# Altium schematic sheet S5_Communications.SchDoc: Communications
size Tabloid; DrawnBy: Dhrumil Parikh; SheetNumber: 5; SheetTotal: 6; PageSetup: Record=PageOptions|CenterHorizontal=True|CenterVertical=True|PrintScale=0.62|XCorrection=1.00|YCorrection=1.00|PrintKind=1|BorderSize=5000000|LeftOffset=0|BottomOffset=0|Orientation=2|PaperLength=1000|PaperWidth=1000|Scale=100|PaperSource=7|PrintQuality=600|MediaType=1|DitherType=10|PaperKind=Letter|PrintScaleMode=1; PageSize: T
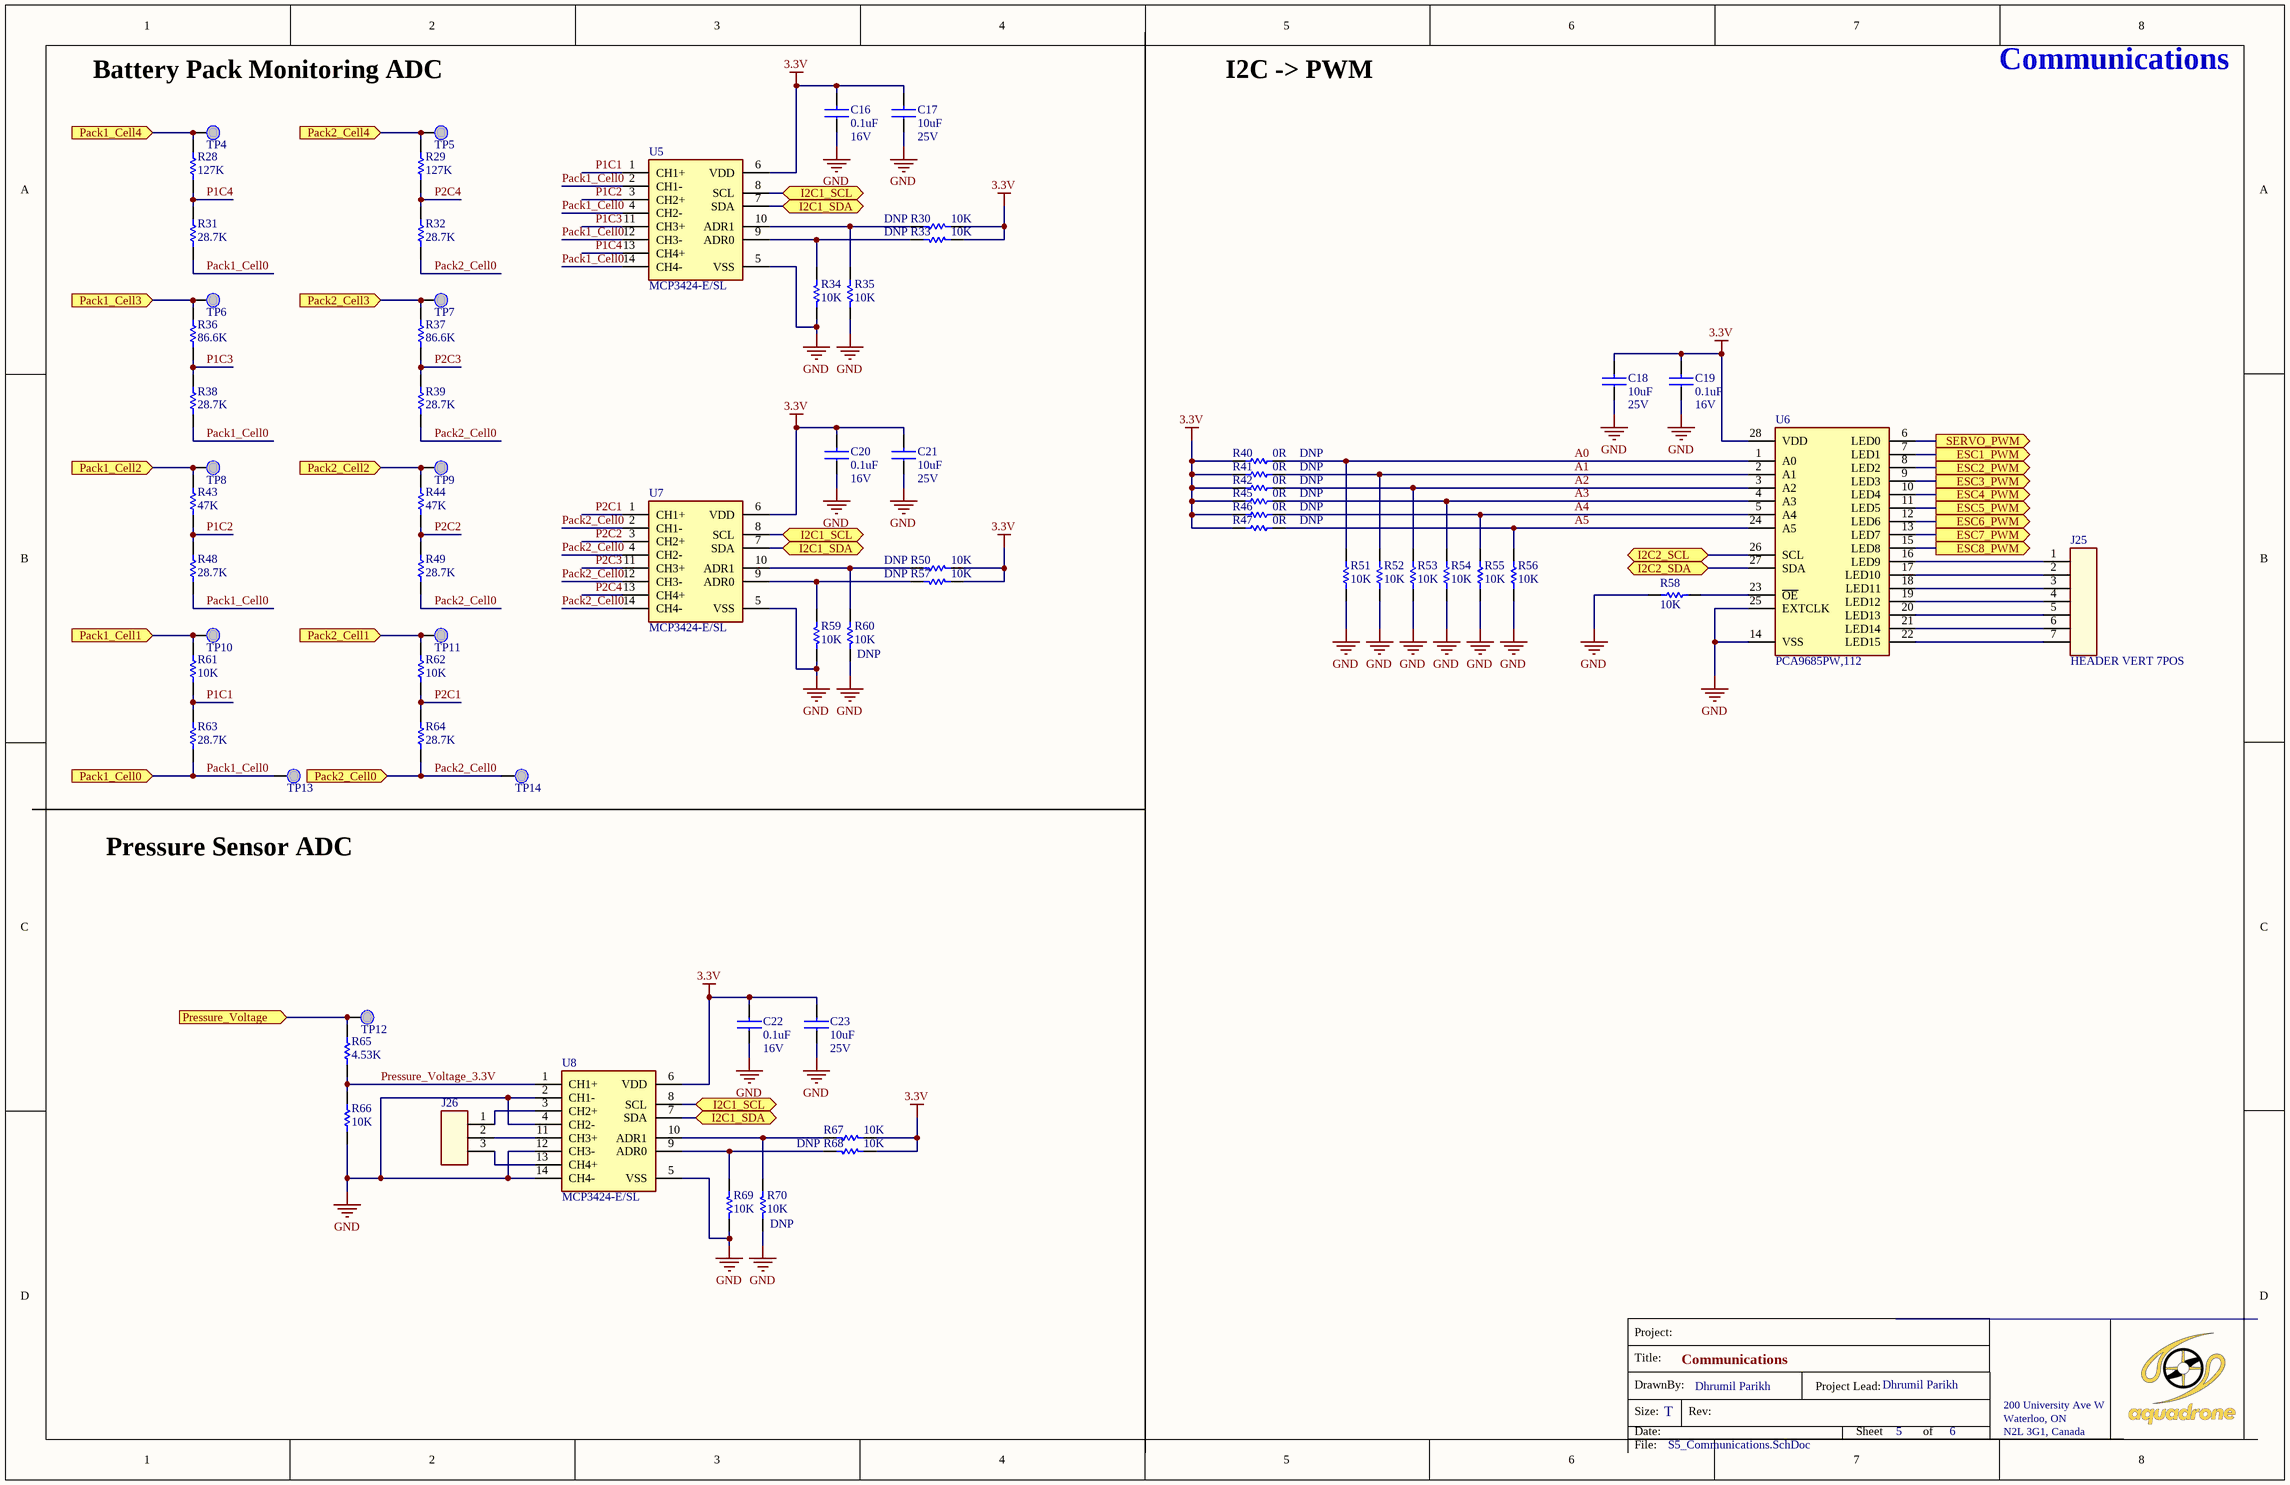
[diagram p0: S5_Communications.SchDoc]

## Parts
C16  value 0.1uF  VOLTAGE: 16V  [CAPC1608X09N]  (hidden comment: CAP CER 0.1UF 16V X7R 0603)
C17  value 10uF  VOLTAGE: 25V  [CAPC1608X09N]  (hidden comment: CAP CER 10UF 25V X5R 0603)
C18  value 10uF  VOLTAGE: 25V  [CAPC1608X09N]  (hidden comment: CAP CER 10UF 25V X5R 0603)
C19  value 0.1uF  VOLTAGE: 16V  [CAPC1608X09N]  (hidden comment: CAP CER 0.1UF 16V X7R 0603)
C20  value 0.1uF  VOLTAGE: 16V  [CAPC1608X09N]  (hidden comment: CAP CER 0.1UF 16V X7R 0603)
C21  value 10uF  VOLTAGE: 25V  [CAPC1608X09N]  (hidden comment: CAP CER 10UF 25V X5R 0603)
C22  value 0.1uF  VOLTAGE: 16V  [CAPC1608X09N]  (hidden comment: CAP CER 0.1UF 16V X7R 0603)
C23  value 10uF  VOLTAGE: 25V  [CAPC1608X09N]  (hidden comment: CAP CER 10UF 25V X5R 0603)
J25  value HEADER VERT 7POS  [61300711121]  (hidden comment: CONN HEADER VERT 7POS 2.54MM)
J26  CONN HEADER VERT 3POS 2.54MM  [61300311121]  (value not drawn)
R28  value 127K  [RESC1608X06N]  (hidden comment: RES SMD 127K OHM 1% 1/10W 0603)
R29  value 127K  [RESC1608X06N]  (hidden comment: RES SMD 127K OHM 1% 1/10W 0603)
R30  value 10K  NOSTUFF: DNP  [RESC1608X06N]  (hidden comment: RES SMD 10K OHM 1% 1/10W 0603)
R31  value 28.7K  [RESC1608X06N]  (hidden comment: RES SMD 28.7K OHM 1% 1/10W 0603)
R32  value 28.7K  [RESC1608X06N]  (hidden comment: RES SMD 28.7K OHM 1% 1/10W 0603)
R33  value 10K  NOSTUFF: DNP  [RESC1608X06N]  (hidden comment: RES SMD 10K OHM 1% 1/10W 0603)
R34  value 10K  [RESC1608X06N]  (hidden comment: RES SMD 10K OHM 1% 1/10W 0603)
R35  value 10K  [RESC1608X06N]  (hidden comment: RES SMD 10K OHM 1% 1/10W 0603)
R36  value 86.6K  [RESC1608X06N]  (hidden comment: RES SMD 86.6K OHM 1% 1/10W 0603)
R37  value 86.6K  [RESC1608X06N]  (hidden comment: RES SMD 86.6K OHM 1% 1/10W 0603)
R38  value 28.7K  [RESC1608X06N]  (hidden comment: RES SMD 28.7K OHM 1% 1/10W 0603)
R39  value 28.7K  [RESC1608X06N]  (hidden comment: RES SMD 28.7K OHM 1% 1/10W 0603)
R40  value 0R  NOSTUFF: DNP  [RESC2012X07N]  (hidden comment: RES SMD 0 OHM JUMPER 1/8W 0805)
R41  value 0R  NOSTUFF: DNP  [RESC2012X07N]  (hidden comment: RES SMD 0 OHM JUMPER 1/8W 0805)
R42  value 0R  NOSTUFF: DNP  [RESC2012X07N]  (hidden comment: RES SMD 0 OHM JUMPER 1/8W 0805)
R43  value 47K  [RESC1608X06N]  (hidden comment: RES SMD 47K OHM 1% 1/10W 0603)
R44  value 47K  [RESC1608X06N]  (hidden comment: RES SMD 47K OHM 1% 1/10W 0603)
R45  value 0R  NOSTUFF: DNP  [RESC2012X07N]  (hidden comment: RES SMD 0 OHM JUMPER 1/8W 0805)
R46  value 0R  NOSTUFF: DNP  [RESC2012X07N]  (hidden comment: RES SMD 0 OHM JUMPER 1/8W 0805)
R47  value 0R  NOSTUFF: DNP  [RESC2012X07N]  (hidden comment: RES SMD 0 OHM JUMPER 1/8W 0805)
R48  value 28.7K  [RESC1608X06N]  (hidden comment: RES SMD 28.7K OHM 1% 1/10W 0603)
R49  value 28.7K  [RESC1608X06N]  (hidden comment: RES SMD 28.7K OHM 1% 1/10W 0603)
R50  value 10K  NOSTUFF: DNP  [RESC1608X06N]  (hidden comment: RES SMD 10K OHM 1% 1/10W 0603)
R51  value 10K  [RESC1608X06N]  (hidden comment: RES SMD 10K OHM 1% 1/10W 0603)
R52  value 10K  [RESC1608X06N]  (hidden comment: RES SMD 10K OHM 1% 1/10W 0603)
R53  value 10K  [RESC1608X06N]  (hidden comment: RES SMD 10K OHM 1% 1/10W 0603)
R54  value 10K  [RESC1608X06N]  (hidden comment: RES SMD 10K OHM 1% 1/10W 0603)
R55  value 10K  [RESC1608X06N]  (hidden comment: RES SMD 10K OHM 1% 1/10W 0603)
R56  value 10K  [RESC1608X06N]  (hidden comment: RES SMD 10K OHM 1% 1/10W 0603)
R57  value 10K  NOSTUFF: DNP  [RESC1608X06N]  (hidden comment: RES SMD 10K OHM 1% 1/10W 0603)
R58  value 10K  [RESC1608X06N]  (hidden comment: RES SMD 10K OHM 1% 1/10W 0603)
R59  value 10K  [RESC1608X06N]  (hidden comment: RES SMD 10K OHM 1% 1/10W 0603)
R60  value 10K  NOSTUFF: DNP  [RESC1608X06N]  (hidden comment: RES SMD 10K OHM 1% 1/10W 0603)
R61  value 10K  [RESC1608X06N]  (hidden comment: RES SMD 10K OHM 1% 1/10W 0603)
R62  value 10K  [RESC1608X06N]  (hidden comment: RES SMD 10K OHM 1% 1/10W 0603)
R63  value 28.7K  [RESC1608X06N]  (hidden comment: RES SMD 28.7K OHM 1% 1/10W 0603)
R64  value 28.7K  [RESC1608X06N]  (hidden comment: RES SMD 28.7K OHM 1% 1/10W 0603)
R65  value 4.53K  [RESC1608X06N]  (hidden comment: RES SMD 4.53K OHM 1% 1/10W 0603)
R66  value 10K  [RESC1608X06N]  (hidden comment: RES SMD 10K OHM 1% 1/10W 0603)
R67  value 10K  [RESC1608X06N]  (hidden comment: RES SMD 10K OHM 1% 1/10W 0603)
R68  value 10K  NOSTUFF: DNP  [RESC1608X06N]  (hidden comment: RES SMD 10K OHM 1% 1/10W 0603)
R69  value 10K  [RESC1608X06N]  (hidden comment: RES SMD 10K OHM 1% 1/10W 0603)
R70  value 10K  NOSTUFF: DNP  [RESC1608X06N]  (hidden comment: RES SMD 10K OHM 1% 1/10W 0603)
TP4  Testpoint 1mm SMD Pad  [TP_SMD_1.0MM]  (value not drawn)  (no BOM)
TP5  Testpoint 1mm SMD Pad  [TP_SMD_1.0MM]  (value not drawn)  (no BOM)
TP6  Testpoint 1mm SMD Pad  [TP_SMD_1.0MM]  (value not drawn)  (no BOM)
TP7  Testpoint 1mm SMD Pad  [TP_SMD_1.0MM]  (value not drawn)  (no BOM)
TP8  Testpoint 1mm SMD Pad  [TP_SMD_1.0MM]  (value not drawn)  (no BOM)
TP9  Testpoint 1mm SMD Pad  [TP_SMD_1.0MM]  (value not drawn)  (no BOM)
TP10  Testpoint 1mm SMD Pad  [TP_SMD_1.0MM]  (value not drawn)  (no BOM)
TP11  Testpoint 1mm SMD Pad  [TP_SMD_1.0MM]  (value not drawn)  (no BOM)
TP12  Testpoint 1mm SMD Pad  [TP_SMD_1.0MM]  (value not drawn)  (no BOM)
TP13  Testpoint 1mm SMD Pad  [TP_SMD_1.0MM]  (value not drawn)  (no BOM)
TP14  Testpoint 1mm SMD Pad  [TP_SMD_1.0MM]  (value not drawn)  (no BOM)
U5  MFG_PART_NO: MCP3424-E/SL  [SOIC127P600X175-14N]  (hidden comment: IC ADC 18BIT SIGMA-DELTA 14SOIC)
U6  MFG_PART_NO: PCA9685PW,112  [SOP65P640X110-28N]  (hidden comment: IC LED DRVR LIN DIM 25MA 28TSSOP)
U7  MFG_PART_NO: MCP3424-E/SL  [SOIC127P600X175-14N]  (hidden comment: IC ADC 18BIT SIGMA-DELTA 14SOIC)
U8  MFG_PART_NO: MCP3424-E/SL  [SOIC127P600X175-14N]  (hidden comment: IC ADC 18BIT SIGMA-DELTA 14SOIC)

## Ports
ESC1_PWM (out), ESC2_PWM (out), ESC3_PWM (out), ESC4_PWM (out), ESC5_PWM (out), ESC6_PWM (out), ESC7_PWM (out), ESC8_PWM (out), I2C1_SCL (bidir), I2C1_SDA (bidir), I2C2_SCL (bidir), I2C2_SDA (bidir), Pack1_Cell0 (in), Pack1_Cell1 (in), Pack1_Cell2 (in), Pack1_Cell3 (in), Pack1_Cell4 (in), Pack2_Cell0 (in), Pack2_Cell1 (in), Pack2_Cell2 (in), Pack2_Cell3 (in), Pack2_Cell4 (in), Pressure_Voltage (in), SERVO_PWM (out)

## Nets
3.3V: C16.2 C17.2 C18.2 C19.2 C20.2 C21.2 C22.2 C23.2 R30.1 R33.1 R40.1 R41.1 R42.1 R45.1 R46.1 R47.1 R50.1 R57.1 R67.1 R68.1 U5.6(VDD) U6.28(VDD) U7.6(VDD) U8.6(VDD)
GND: C16.1 C17.1 C18.1 C19.1 C20.1 C21.1 C22.1 C23.1 R34.1 R35.1 R51.1 R52.1 R53.1 R54.1 R55.1 R56.1 R58.1 R59.1 R60.1 R66.1 R69.1 R70.1 U5.5(VSS) U6.14(VSS) U6.25(EXTCLK) U7.5(VSS) U8.2(CH1-) U8.4(CH2-) U8.5(VSS) U8.12(CH3-) U8.14(CH4-)
A0: R40.2 R51.2 U6.1(A0)
A1: R41.2 R52.2 U6.2(A1)
A2: R42.2 R53.2 U6.3(A2)
A3: R45.2 R54.2 U6.4(A3)
A4: R46.2 R55.2 U6.5(A4)
A5: R47.2 R56.2 U6.24(A5)
ESC1_PWM: U6.7(LED1) ; port ESC1_PWM
ESC2_PWM: U6.8(LED2) ; port ESC2_PWM
ESC3_PWM: U6.9(LED3) ; port ESC3_PWM
ESC4_PWM: U6.10(LED4) ; port ESC4_PWM
ESC5_PWM: U6.11(LED5) ; port ESC5_PWM
ESC6_PWM: U6.12(LED6) ; port ESC6_PWM
ESC7_PWM: U6.13(LED7) ; port ESC7_PWM
ESC8_PWM: U6.15(LED8) ; port ESC8_PWM
I2C1_SCL: U5.8(SCL) U7.8(SCL) U8.8(SCL) ; port I2C1_SCL
I2C1_SDA: U5.7(SDA) U7.7(SDA) U8.7(SDA) ; port I2C1_SDA
I2C2_SCL: U6.26(SCL) ; port I2C2_SCL
I2C2_SDA: U6.27(SDA) ; port I2C2_SDA
P1C1: R61.1 R63.2 U5.1(CH1+)
P1C2: R43.1 R48.2 U5.3(CH2+)
P1C3: R36.1 R38.2 U5.11(CH3+)
P1C4: R28.1 R31.2 U5.13(CH4+)
P2C1: R62.1 R64.2 U7.1(CH1+)
P2C2: R44.1 R49.2 U7.3(CH2+)
P2C3: R37.1 R39.2 U7.11(CH3+)
P2C4: R29.1 R32.2 U7.13(CH4+)
Pack1_Cell0: R31.1 R38.1 R48.1 R63.1 TP13.1 U5.2(CH1-) U5.4(CH2-) U5.12(CH3-) U5.14(CH4-) ; port Pack1_Cell0
Pack1_Cell1: R61.2 TP10.1 ; port Pack1_Cell1
Pack1_Cell2: R43.2 TP8.1 ; port Pack1_Cell2
Pack1_Cell3: R36.2 TP6.1 ; port Pack1_Cell3
Pack1_Cell4: R28.2 TP4.1 ; port Pack1_Cell4
Pack2_Cell0: R32.1 R39.1 R49.1 R64.1 TP14.1 U7.2(CH1-) U7.4(CH2-) U7.12(CH3-) U7.14(CH4-) ; port Pack2_Cell0
Pack2_Cell1: R62.2 TP11.1 ; port Pack2_Cell1
Pack2_Cell2: R44.2 TP9.1 ; port Pack2_Cell2
Pack2_Cell3: R37.2 TP7.1 ; port Pack2_Cell3
Pack2_Cell4: R29.2 TP5.1 ; port Pack2_Cell4
Pressure_Voltage: R65.2 TP12.1 ; port Pressure_Voltage
Pressure_Voltage_3.3V: R65.1 R66.2 U8.1(CH1+)
SERVO_PWM: U6.6(LED0) ; port SERVO_PWM
NetJ25_1: J25.1 U6.16(LED9)
NetJ25_2: J25.2 U6.17(LED10)
NetJ25_3: J25.3 U6.18(LED11)
NetJ25_4: J25.4 U6.19(LED12)
NetJ25_5: J25.5 U6.20(LED13)
NetJ25_6: J25.6 U6.21(LED14)
NetJ25_7: J25.7 U6.22(LED15)
NetJ26_1: J26.1 U8.3(CH2+)
NetJ26_2: J26.2 U8.11(CH3+)
NetJ26_3: J26.3 U8.13(CH4+)
NetR30_2: R30.2 R35.2 U5.10(ADR1)
NetR33_2: R33.2 R34.2 U5.9(ADR0)
NetR50_2: R50.2 R60.2 U7.10(ADR1)
NetR57_2: R57.2 R59.2 U7.9(ADR0)
NetR58_2: R58.2 U6.23(~{OE})
NetR67_2: R67.2 R70.2 U8.10(ADR1)
NetR68_2: R68.2 R69.2 U8.9(ADR0)

## Notes on the sheet
- Battery Pack Monitoring ADC
- I2C -> PWM
- Pressure Sensor ADC
- Title:
- Project:
- Size:
- Date:
- DrawnBy:
- Rev:
- Project Lead:
- Sheet
- Dhrumil Parikh
- of
- 200 University Ave W
- Waterloo, ON
- N2L 3G1, Canada
- File:

## Library data of the parts
C16 C19 C20 C22 = CAP CER 0.1UF 16V X7R 0603: MFG_PART_NO: C0603C104M4RACTU; MFG: KEMET; TOLERANCE: 20%; COST: 0.14; DIELECTRIC: X7R
C17 C18 C21 C23 = CAP CER 10UF 25V X5R 0603: MFG_PART_NO: C1608X5R1E106M080AC; MFG: KEMET; TOLERANCE: 20%; COST: 0.14; DIELECTRIC: X5R
J25 = CONN HEADER VERT 7POS 2.54MM: MFG: Wurth Electronics Inc.; COST: 0.53; MFG_PART_NO: 61300711121
J26 = CONN HEADER VERT 3POS 2.54MM: MFG: Wurth Electronics Inc.; COST: 0.18; MFG_PART_NO: 61300311121; VALUE: HEADER VERT 3POS
R28 R29 = RES SMD 127K OHM 1% 1/10W 0603: MFG_PART_NO: CRCW0603127KFKEA; MFG: Vishay Dale; COST: 0.15; TOLERANCE: 1%
R30 R33-R35 R50-R62 R66-R70 = RES SMD 10K OHM 1% 1/10W 0603: MFG_PART_NO: CRCW060310K0FKEA; MFG: Vishay Dale; COST: 0.15; TOLERANCE: 1%
R31 R32 R38 R39 R48 R49 R63 R64 = RES SMD 28.7K OHM 1% 1/10W 0603: MFG_PART_NO: RC0603FR-0728K7L; MFG: Yageo; COST: 0.15; TOLERANCE: 1%
R36 R37 = RES SMD 86.6K OHM 1% 1/10W 0603: MFG_PART_NO: RC0603FR-0786K6L; MFG: Yageo; COST: 0.15; TOLERANCE: 1%
R40-R42 R45-R47 = RES SMD 0 OHM JUMPER 1/8W 0805: MFG_PART_NO: ERJ-6GEY0R00V; MFG: Panasonic; COST: 0.15
R43 R44 = RES SMD 47K OHM 1% 1/10W 0603: MFG_PART_NO: RC0603FR-0747KL; MFG: Yageo; COST: 0.15; TOLERANCE: 1%
R65 = RES SMD 4.53K OHM 1% 1/10W 0603: MFG_PART_NO: RC0603FR-074K53L; MFG: Yageo; COST: 0.15; TOLERANCE: 1%
TP4-TP14 = Testpoint 1mm SMD Pad: Testpoint 1.0mm SMD Pad; VALUE: TP_SMD_1.0MM; ROHS: Y; STATUS: CHECKED
U5 U7 U8 = IC ADC 18BIT SIGMA-DELTA 14SOIC: MFG: Microchip Technology; VALUE: MCP3424-E/SL; COST: 5.98
U6 = IC LED DRVR LIN DIM 25MA 28TSSOP: MFG: NXP USA Inc.; VALUE: PCA9685PW,112; COST: 3.46